# Altium schematic sheet Power.SchDoc
size B; SheetNumber: 2; SheetTotal: 3
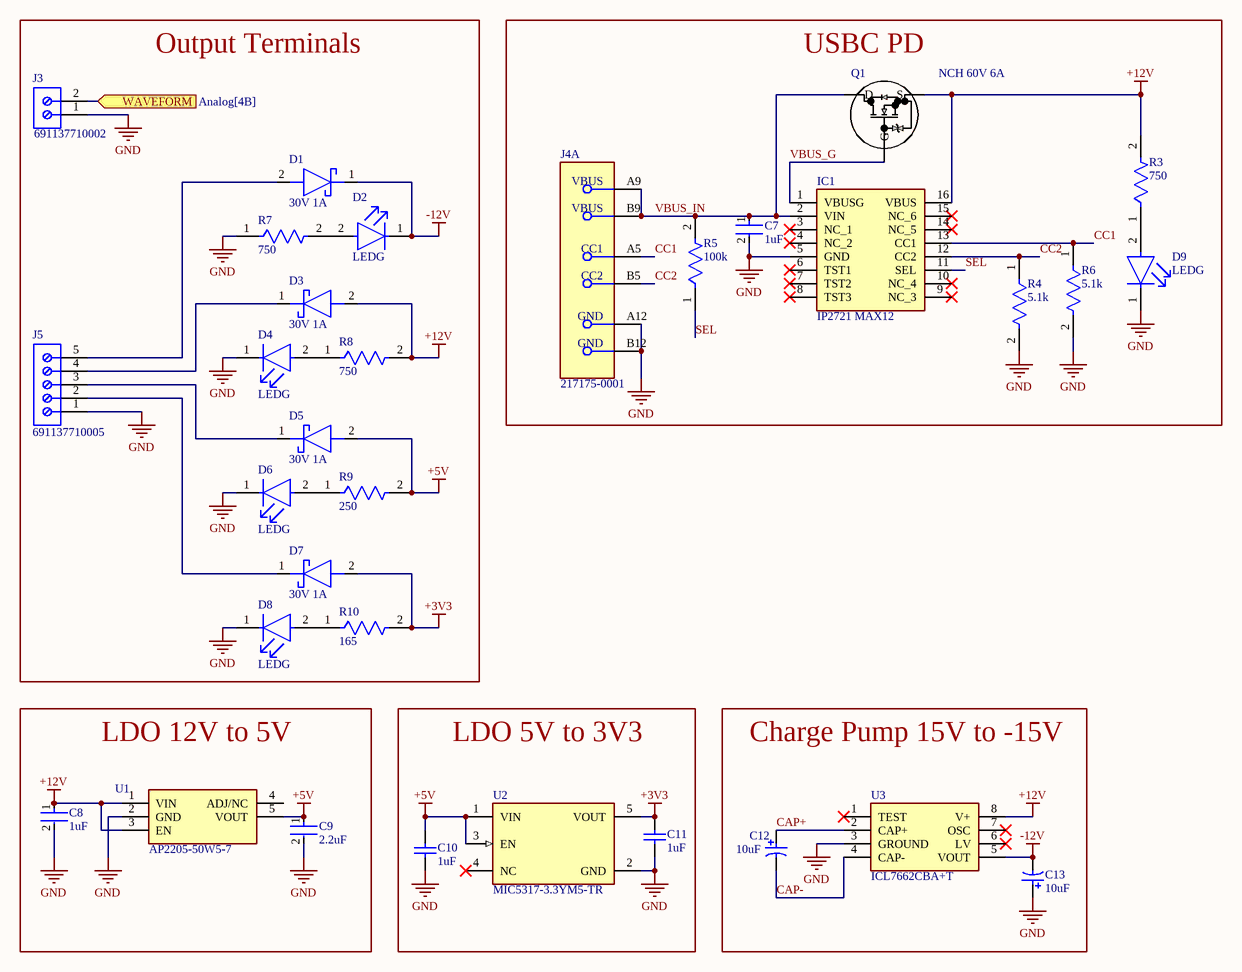
[diagram p0: Power.SchDoc]

## Parts
C7  1uF  [FP-CGA5L-0_3-0_1-IPC_B]
C8  1uF  [FP-CGA5L-0_3-0_1-IPC_B]
C9  2.2uF  [FP-C0402-BB-MFG]
C10  1uF  [CAPC1206(3216)130_N]
C11  1uF  [CAPC1206(3216)130_N]
C12  10uF  [VISH-293D-E_L]
C13  10uF  [VISH-293D-E_L]
D1  30V 1A  [1SS357TPH3F]
D2  LEDG  [FP-LTST-C170GKT-MFG]
D3  30V 1A  [1SS357TPH3F]
D4  LEDG  [FP-LTST-C170GKT-MFG]
D5  30V 1A  [1SS357TPH3F]
D6  LEDG  [FP-LTST-C170GKT-MFG]
D7  30V 1A  [1SS357TPH3F]
D8  LEDG  [FP-LTST-C170GKT-MFG]
D9  LEDG  [FP-LTST-C170GKT-MFG]
IC1  IP2721 MAX12  [SOP65P640X120-16N]
J3  691137710002  [691137710002]
J4  217175-0001  [FP-217175-0001-MFG]  (part A of 2)
J5  691137710005  [691137710005]
Q1  NCH 60V 6A  [SOT-323F_2-2U1S_UFM_TOS]
R3  750  [FP-AT0805-IPC_C]
R4  5.1k  [FP-TFCR0603-IPC_A]
R5  100k  [FP-MCU0805-IPC_B]
R6  5.1k  [FP-TFCR0603-IPC_A]
R7  750  [FP-RMCF0805-MFG]
R8  750  [FP-RMCF0805-MFG]
R9  250  [FP-RMCF0805-MFG]
R10  165  [FP-TFCR0603-IPC_B]
U1  AP2205-50W5-7  [SOT95P285X140-5N]
U2  MIC5317-3.3YM5-TR  [FP-SOT23-5LD-PL-1-MFG]
U3  ICL7662CBA+T  [SOIC127P600X175-8N]

## Blocks framed on the sheet
Output Terminals: D1-D8 J3 J5 R7-R10
USBC PD: C7 D9 IC1 J4 Q1 R3-R6
LDO 12V to 5V: C8 C9 U1
LDO 5V to 3V3: C10 C11 U2
Charge Pump 15V to -15V: C12 C13 U3

## Ports
WAVEFORM (in, see Analog[4B])

## Nets
+3V3: C11.2 D7.2(A) R10.2 U2.5(VOUT)
+5V: C9.1 C10.2 D5.2(A) R9.2 U1.5(VOUT) U2.1(VIN) U2.3(EN)
+12V: C8.1 D3.2(A) IC1.16(VBUS) Q1.2(S) R3.2 R8.2 U1.1(VIN) U1.3(EN) U3.8(V+)
-12V: C13.2 D1.1(K) D2.1(C) U3.5(VOUT)
GND: C7.2 C8.2 C9.2 C10.1 C11.1 C13.1 D4.1(C) D6.1(C) D8.1(C) D9.1(C) IC1.5(GND) J3.1 J4.A12(GND) J4.B12(GND) J5.1 R4.2 R6.2 R7.1 U1.2(GND) U2.2(GND) U3.3(GROUND)
CAP+: C12.1 U3.2(CAP+)
CAP-: C12.2 U3.4(CAP-)
CC1: IC1.13(CC1) J4.A5(CC1) R6.1
CC2: IC1.12(CC2) J4.B5(CC2) R4.1
SEL: IC1.11(SEL) R5.1
VBUS_G: IC1.1(VBUSG) Q1.1(G)
VBUS_IN: C7.1 IC1.2(VIN) J4.A9(VBUS) J4.B9(VBUS) Q1.3(D) R5.2
WAVEFORM: J3.2 ; port WAVEFORM
NetD1_2: D1.2(A) J5.5
NetD2_2: D2.2(A) R7.2
NetD3_1: D3.1(K) J5.4
NetD4_2: D4.2(A) R8.1
NetD5_1: D5.1(K) J5.3
NetD6_2: D6.2(A) R9.1
NetD7_1: D7.1(K) J5.2
NetD8_2: D8.2(A) R10.1
NetD9_2: D9.2(A) R3.1

Not connected (* = marked no-connect by the designer): IC1 3(NC_1)* 4(NC_2)* 6(TST1)* 7(TST2)* 8(TST3)* 9(NC_3)* 10(NC_4)* 14(NC_5)* 15(NC_6)*; U1 4(ADJ/NC); U2 4(NC)*; U3 1(TEST)* 6(LV)* 7(OSC)*

## Library data of the parts
C7 C8 = CMP-08246-000049-1: Cap Ceramic 1uF 25V X7R 20% Pad SMD 1206 +125°C Automotive T/R; Voltage Rating (DC): 25V; Case Code (Imperial): 1206; Capacitance: 1uF; Packaging: Tape and Reel; Package Quantity: 2000; Tolerance: 20%; Weight: 0.000571oz; Case/Package: 1206; Case Code (Metric): 3216; Max Operating Temperature: 125°C; Voltage Rating: 25V; Mount: Surface Mount; Thickness: 0.063inch; Ratings: AEC-Q200; Min Operating Temperature: -55°C; Width: 1.6mm; Height: 1.6mm; Dielectric: X7R; Length: 0.126inch
C9 = CMP-1034-01660-3: C0402; Manufacturer: Kemet; Manufacturer Part Number: C0402C132K8GACTU; Capacitance: 1,300 pF; Material: Ceramic; Voltage Rating: 10 V; Temperature Characteristic: C0G; Tolerance: 0.1; Value: 1,300 pF; ComponentLink2Description: Datasheet; Automotive: No; Ipc Land Pattern Name: CAPC10050X50; ComponentLink2URL: https://content.kemet.com/datasheets/KEM_C1002_X7R_SMD.pdf; Temperature Range High: +125°C; Device Class L1: Passive Components; Mouser Description: Cap, 1300PF, 10V, Mlcc, 0402; RoHS: TRUE; Category: Cap; Temperature: -55°C to +125°C; Temperature Range Low: -55°C; Package: C0402-BB; Lead Free: Yes; Octopart: https://octopart.com/c0402c132k8gactu-kemet-56745629; Device Class L3: Ceramic Capacitors; Height: 0.55mm; Device Class L2: Capacitors
C10 C11 = CMP-1037-04671-1: CAP 1uF 10V ±5% 1206 (3216 Metric) Thickness 1.3mm SMD; Case-EIA: 1206; Tolerance: Â±5%; Case-Metric: 3216; Value: 1uF; Technology: SMT; Rated Voltage: 10 V; Max Thickness: 1.3 mm
C12 C13 = CMP-2000-05556-1: Tantalum Capacitor, 10 uF, +/- 10%, 50 V, -55 to 125 degC, 2-Pin SMD (7343-43), RoHS, Tape and Reel; Manufacturer: Vishay; Capacitance: 10000000pF; Product Height (mm): 4mm; Lead Spacing (nom): NotRequiredmm; Product Depth (mm): 4.3mm; Seal: NotRequired; Case Style: Molded; DELETED: Compliant; Voltage: 50VDC; Product Length (mm): 7.3mm; Polarity: Polar; ESR: 0.8ohm; DF: 6%; Rad Hardened: No; DCL: 5uA; Package Description: 2-Pin Surface Mount Device, Body 7.3 x 4.3 mm; Datasheet URL: http://www.vishay.com/docs/40002/293d.pdf; Operating Temp Range: -55Cto125C; Seated Plane Height: NotRequiredmm; Mounting Technology: SurfaceMount; Insulation: NotRequired; Failure Rate: NotRequired; Construction: SMTChip; Packaging: TapeandReel; Mounting Style: SurfaceMount; Tolerance (+ or -): 10%; Product Diameter (mm): NotRequiredmm; Length W/Weld (max): NotRequiredmm; Length W/Weld: NotRequiredmm; Case Code: E; Datasheet Version: 08/2016; Package Reference: 293D-E; Package / Case: 7343-43; Manufacturer URL: http://www.vishay.com/; Wire Form: NotRequired
D1 D3 D5 D7 = CUS10S30,H3F: Schottky Diode; Manufacturer_Name: Toshiba; Datasheet Link: http://toshiba.semicon-storage.com/info/docget.jsp?did=14077&prodName=CUS10S30; Height: 1mm; Manufacturer_Part_Number: CUS10S30,H3F; Mouser Part Number: 757-CUS10S30H3F; Mouser Price/Stock: https://www.mouser.co.uk/ProductDetail/Toshiba/CUS10S30H3F?qs=cW4DzVrAanO4Xm6ySrHr7g%3D%3D; Arrow Part Number: CUS10S30,H3F; Arrow Price/Stock: https://www.arrow.com/en/products/cus10s30h3f/toshiba?utm_currency=USD&region=nac
D2 D4 D6 D8 D9 = CMP-1674-00002-6: LED GREEN CLEAR SMD; Dominant Wavelength: 569nm; Lens Style: Diffused; Forward Voltage: 2.1V; Number of Elements: 1; Wavelength: 565nm; Luminous Intensity: 6mcd; Test Current: 10mA; Power Dissipation: 100mW; Reverse Voltage: 5V; Forward Current: 30mA; Viewing Angle: 130°; Lens Color: Colorless; Min Operating Temperature: -55°C; Number of Pins: 2; Max Operating Temperature: 85°C; Color: Green; Radiation Hardening: No; Illumination Color: Green; Case Code (Metric): 2012; Lens Transparency: Clear; Case/Package: 0805; Width: 1.25mm; Case Code (Imperial): 0805; Package Quantity: 1; Height: 1.1mm; Depth: 1.25mm; Length: 2mm; Power Rating: 100mW; Lead Free: Lead Free; Number of LEDs: 1; Packaging: Tape and Reel; Mount: Surface Mount; Voltage: 5V
IC1 = IP2721: Integrated Circuit; Manufacturer_Name: INJOINIC; Datasheet Link: https://datasheet.lcsc.com/szlcsc/2006111335_INJOINIC-IP2721_C603176.pdf; Height: 1.2mm; Manufacturer_Part_Number: IP2721
J3 = CMP-1502-03324-2: NexarPartId: 78871135; Voltage Rating: 300V; Number of Contacts: 2; Current Rating: 16A; Lead Pitch: 5mm; Height: 11.6mm; Packaging: Box; RoHS: Non-Compliant; Contact Material: Nickel, Tin; Max Operating Temperature: 120°C; Number of Pins: 2; Min Operating Temperature: -30°C; Number of Rows: 1
J4 = CMP-04767-000026-1: CONN RCP USB2.0 C 6+18P SMD RA
J5 = CMP-1502-03327-2: NexarPartId: 78871141; Lead Pitch: 5mm; RoHS: Non-Compliant; Number of Pins: 5; Packaging: Box
Q1 = SSM3K341TU,LF: N-ch MOSFET, 60 V, 6.0 A, 0.036 Î©@10V, SOT-323F(UFM); Manufacturer_Name: Toshiba Electronic Devices & Storage Corp.; Copyright: Copyright (C) 2025 Ultra Librarian. All rights reserved.; Manufacturer_Part_Number: SSM3K341TU,LF; Datasheet: https://toshiba.semicon-storage.com/info/docget.jsp?did=56016&prodName=SSM3K341TU
R3 = CMP-03412-048709-1: Thin Film Chip Resistors Automotive Grade 10kΩ 0.1% 50ppm/°C 0805
R4 R6 = CMP-250906-167103-1: RES Thin Film,  5.1kΩ, 0.25%, 0.1W, 25ppm/°C, 0603
R5 = CMP-02407-004057-1: 0805
R7 R8 = CMP-26527-002688-1: 6.8kΩ ±5% 0.125W 0805 Thick Film Chip Resistor AEC-Q200 compliant; Power Rating: 125mW; Resistance: 6.8kR; Temperature Coefficient: 200ppm/°C; Contact Plating: Tin; Tolerance: 5%; Mount: Surface Mount; Lead Free: Lead Free; Max Operating Temperature: 155°C; Case Code (Metric): 2012; Construction: Rectangular; RoHS Compliant: Yes; Height: 0.026inch; Depth: 1.25mm; Length: 0.079inch; Features: Automotive AEC-Q200; Military Standard: Not; Number of Terminations: 2; Case Code (Imperial): 0805; Resistor Type: Thick Film; Series: RMCF; Max Power Dissipation: 125mW; Size Code: 0805; Radiation Hardening: No; Min Operating Temperature: -55°C; Case/Package: 0805; Packaging: Tape and Reel; Width: 0.049inch
R9 = CMP-26527-002688-1: 0805 250 Ohms 0.25W; Tolerance: 5%; Power Rating: 125mW; Resistance: 6.8kR; Temperature Coefficient: 200ppm/°C; Contact Plating: Tin; Mount: Surface Mount; Lead Free: Lead Free; Max Operating Temperature: 155°C; Case Code (Metric): 2012; Construction: Rectangular; RoHS Compliant: Yes; Height: 0.026inch; Depth: 1.25mm; Length: 0.079inch; Features: Automotive AEC-Q200; Military Standard: Not; Number of Terminations: 2; Case Code (Imperial): 0805; Resistor Type: Thick Film; Series: RMCF; Max Power Dissipation: 125mW; Size Code: 0805; Radiation Hardening: No; Min Operating Temperature: -55°C; Case/Package: 0805; Packaging: Tape and Reel; Width: 0.049inch
R10 = CMP-250906-226900-1: RES Thin Film,  620Ω, 0.25%, 0.1W, 25ppm/°C, 0603
U1 = AP2205-50W5-7: Integrated Circuit; Manufacturer_Name: Diodes Incorporated; Datasheet Link: https://www.diodes.com//assets/Datasheets/AP2205.pdf; Height: 1.4mm; Manufacturer_Part_Number: AP2205-50W5-7; Mouser Part Number: 621-AP2205-50W5-7; Mouser Price/Stock: https://www.mouser.co.uk/ProductDetail/Diodes-Incorporated/AP2205-50W5-7?qs=EBDBlbfErPynTgfSbFnU%252BQ%3D%3D; Arrow Part Number: AP2205-50W5-7; Arrow Price/Stock: https://www.arrow.com/en/products/ap2205-50w5-7/diodes-incorporated?region=europe
U2 = CMP-06324-000116-1: IC REG LINEAR 3.3V 150MA SOT23-5; Max Input Voltage: 6V; Number of Regulators: 1; Min Current Limit: 200mA; Dropout Voltage: 155mV; Min Input Voltage: 2.5V; Power Supply Rejection Ratio (PSRR): 70dB; Case/Package: SOT-23-5; Output Voltage: 3.3V; Series: -; Max Operating Temperature: 125°C; Package Quantity: 3000; Mount: Surface Mount; Packaging: Tape and Reel; RoHS Compliant: No; Output Current: 150mA; Min Operating Temperature: -40°C; Number of Outputs: 1
U3 = ICL7662CBA+T: Integrated Circuit; Manufacturer_Name: Analog Devices; Datasheet Link: https://datasheet.datasheetarchive.com/originals/dk/DKDS-7/135327.pdf; Height: 1.75mm; Manufacturer_Part_Number: ICL7662CBA+T; Mouser Part Number: 700-ICL7662CBAT; Mouser Price/Stock: https://www.mouser.co.uk/ProductDetail/Analog-Devices-Maxim-Integrated/ICL7662CBA%2bT?qs=Mqkh4jHMT8yEwIZBI%252Brh9g%3D%3D; Arrow Part Number: ICL7662CBA+T; Arrow Price/Stock: https://www.arrow.com/en/products/icl7662cbat/analog-devices?region=nac